# Altium schematic sheet D2.SchDoc
size A; SheetNumber: 1; SheetTotal: 1
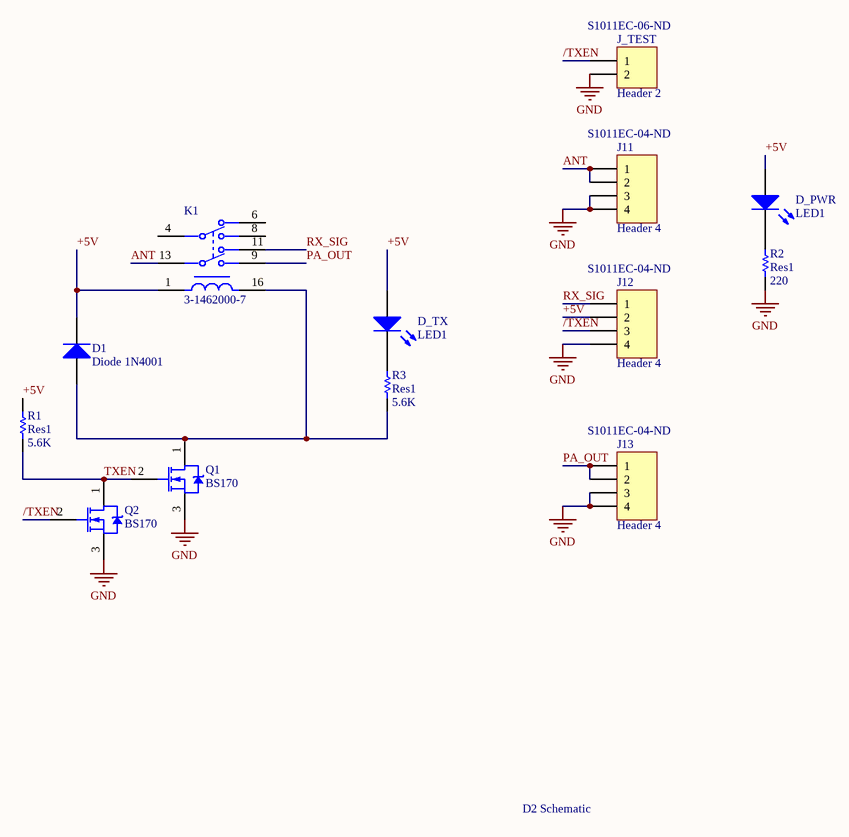
[diagram p0: D2.SchDoc]

## Parts
D1  Diode 1N4001  [DO-41]
D_PWR  LED1  [LED-1]
D_TX  LED1  [LED-1]
J11  Header 4  Supplier Part Number 1: S1011EC-04-ND  [HDR1X4]
J12  Header 4  Supplier Part Number 1: S1011EC-04-ND  [HDR1X4]
J13  Header 4  Supplier Part Number 1: S1011EC-04-ND  [HDR1X4]
J_TEST  Header 2  Supplier Part Number 1: S1011EC-06-ND  [HDR1X2]
K1  3-1462000-7  [FP-3-1462000-7-MFG]
Q1  BS170  [ONSC-TO-92-3-29-11]
Q2  BS170  [ONSC-TO-92-3-29-11]
R1  Res1  value 5.6K  [AXIAL-0.1-RES]
R2  Res1  value 220  [AXIAL-0.1-RES]
R3  Res1  value 5.6K  [AXIAL-0.1-RES]

## Nets
GND: J11.3 J11.4 J12.4 J13.3 J13.4 J_TEST.2 Q1.3(S) Q2.3(S) R2.1
+5V: D1.2(K) D_PWR.1(A) D_TX.1(A) J12.2 K1.1 R1.1
/TXEN: J12.3 J_TEST.1 Q2.2(G)
ANT: J11.1 J11.2 K1.13
PA_OUT: J13.1 J13.2 K1.9
RX_SIG: J12.1 K1.11
TXEN: Q1.2(G) Q2.1(D) R1.2
NetD1_1: D1.1(A) K1.16 Q1.1(D) R3.2
NetD_PWR_2: D_PWR.2(K) R2.2
NetD_TX_2: D_TX.2(K) R3.1

Not connected (* = marked no-connect by the designer): K1 4 6 8

## Notes on the sheet
- D2 Schematic

## Library data of the parts
D1 = Diode 1N4001: 1 Amp General Purpose Rectifier; Published: 8-Jun-2000; LatestRevisionDate: 17-Jul-2002; LatestRevisionNote: Re-released for DXP Platform.; DatasheetVersion: 1998; PackageVersion: Aug-1999; PackageReference: DO-41; Publisher: Altium Limited; PackageDescription: Diode, Axial; Body 5.2 x 2.7 mm (LxDia. max), Lead Dia. 0.86 mm (max); Code_JEDEC: DO-204-AL; ComponentLink1Description: Manufacturer Link; ComponentLink1URL: http://www.fairchildsemi.com/; ComponentLink2Description: Datasheet; ComponentLink2URL: http://www.fairchildsemi.com/ds/1N%2F1N4001.pdf
D_PWR D_TX = LED1: Typical RED GaAs LED; Published: 8-Jun-2000; LatestRevisionDate: 08-Jul-2005; LatestRevisionNote: Mech Layer 1 removed.; PackageReference: LED-1; Publisher: Altium Limited; PackageDescription: LED; 2 Leads
J11-J13 = Header 4: Conn Header Vert 4POS 2.54MM; Manufacturer: Sullins; Manufacturer Part Number: PRPC004SAAN-RC; Number of Positions: 4; Connector Type: Male Pin; Pitch: 0.1inch; LatestRevisionDate: 17-Jul-2002; LatestRevisionNote: Re-released for DXP Platform.; Publisher: Altium Limited; Supplier 1: Digi-Key; RoHS: Yes; Category: Connectors; Stock 1: 11511; Pricing 1: 1=0.15000, 10=0.14600, 25=0.10840, 50=0.09280, 100=0.08980, 250=0.07740, 500=0.07430 (USD); Mount: Through Hole; Color: Black; Contact Plating: Gold; Package Quantity: 1; Number of Rows: 1; Packaging: Bulk; Termination: Solder; Series: -; Contact Type: Male Pin; Contact Mating Length: 0.23inch; RoHS Compliant: Yes; ComponentLink1URL: https://datasheet.ciiva.com/741/xrxczzzsxxn-rc-st-11635-b-741241.pdf?src-supplier=Digi-Key; ComponentLink1Description: https://datasheet.ciiva.com/741/xrxczzzsxxn-rc-st-11635-b-741241.pdf?src-supplier=Digi-Key
J_TEST = Header 2: Conn Header .100" Sngl Str 6POS; Manufacturer: Sullins; Manufacturer Part Number: PRPC006SAAN-RC; Number of Positions: 6; Connector Type: Male Pin; Pitch: 0.1inch; LatestRevisionDate: 17-Jul-2002; LatestRevisionNote: Re-released for DXP Platform.; Publisher: Altium Limited; Supplier 1: Digi-Key; RoHS: Yes; Category: Connectors; Stock 1: 12450; Pricing 1: 1=0.19000, 10=0.17400, 25=0.14880, 50=0.13000, 100=0.12070, 250=0.10680, 500=0.10216 (USD); Mount: Through Hole; Color: Black; Contact Plating: Gold; Package Quantity: 1; Number of Rows: 1; Packaging: Bulk; Termination: Solder; Series: -; Contact Type: Male Pin; Contact Mating Length: 0.23inch; Lead Free: Lead Free; RoHS Compliant: Yes; ComponentLink1URL: https://datasheet.ciiva.com/741/xrxczzzsxxn-rc-st-11635-b-741239.pdf?src-supplier=Digi-Key; ComponentLink1Description: https://datasheet.ciiva.com/741/xrxczzzsxxn-rc-st-11635-b-741239.pdf?src-supplier=Digi-Key
K1 = CMP-03396-000026-1: RELAY TELECOM DPDT 2A 12VDC; Manufacturer: TE Connectivity; Number Of Contacts: 2; Coil Resistance: 720Ω; Coil Voltage: 12V; Coil Type: Non-Latching; Coil Power: 200mW; Standoff Height: 0.2mm; Current Rating: 2A; Device Class L2: Relays; Category: Relay; Device Class L3: Signal Relays; Temperature Range Low: -55°C; Digikey Description: RELAY TELECOM DPDT 2A 12VDC; Lead Free: Yes; Switching Current: 2A; Manufacturer Part Number: 3-1462000-7; Ambient Temperature Range High: +85°C; ComponentLink2Description: Datasheet; Mouser Description: Low Signal Relays - PCB 1.25AMP 2 FORM C 12V DPDT 2C/O; ComponentLink2URL: https://www.te.com/usa-en/product-3-1462000-7.html?te_bu=Cor&te_type=other&te_campaign=oct_glo_cor-oct-global-oth-prtnr-fy19-oct-octo-buy-bom_sma-298_2&elqCampaignId=35216; Package: 3-1462000-7; Device Class L1: Electromechanical; Ambient Temperature Range Low: -55°C; RoHS: TRUE; Height: 10.9mm; Octopart: https://octopart.com/3-1462000-7-te+connectivity-40092230; Throw Configuration: DPDT; Temperature: -55°C to +85°C; Temperature Range High: +85°C; Automotive: No
Q1 Q2 = CMP-1058-00929-1: Small Signal MOSFET, 500 mA, 60 V, N-Channel, 3-Pin TO-92, Bulk Box; Manufacturer: On Semiconductor; VGS Max (V): 20; Configuration: Single; PD Max (W): 0.35; VGS(th) Max (V): 3; ID Max (A): 0.5; V(BR)DSS Min (V): 60; Channel Polarity: N Channel; PackageDescription: 3-Pin Transistor Outline, Body 4.825 x 3.685 mm, Pitch 1.27 mm; Package Type: TO-92; ComponentLink1Description: Manufacturer URL; ComponentLink1URL: http://www.onsemi.com/; DatasheetVersion: Rev. 6; ComponentLink3Description: Package Specification; PartNumber: BS170; ComponentLink2URL: http://www.onsemi.com/pub_link/Collateral/BS170-D.PDF; PackageVersion: Rev. AM; Mounting Technology: Through Hole; PackageReference: TO-92-3-29-11_AM_SL; ComponentLink2Description: Datasheet; ComponentLink3URL: http://www.onsemi.cn/pub_link/Collateral/2N6426-D.PDF; Packing: Bulk Box
R1 R3 = RES 5.6K OHM 5% 1/4W AXIAL: Resistor; Manufacturer Part Number: CFR-25JB-52-5K6; Designator: R?; Power Rating: 1/4W; Tolerance: 0.05; Published: 8-Jun-2000; LatestRevisionDate: 17-Jul-2002; LatestRevisionNote: Re-released for DXP Platform.; Publisher: Altium Limited
R2 = RES 270 OHM 5% 1/4W AXIAL: Resistor; Manufacturer Part Number: CFR-25JB-52-270R; Designator: R?; Power Rating: 1/4W; Tolerance: 0.05; Published: 8-Jun-2000; LatestRevisionDate: 17-Jul-2002; LatestRevisionNote: Re-released for DXP Platform.; Publisher: Altium Limited